# EasyEDA Pro project stm32f103VET6_开发板.eprj, schematic Schematic1

## Sheets
1 主控: Board Name: Board1; Create Date: 2025-05-25; Page Name: 主控; Project Name: stm32f103VET6_开发板; Schematic Name: Schematic1; Update Date: 2025-05-26; Company: 嘉立创EDA; Page Size: A4; Version: V1.0
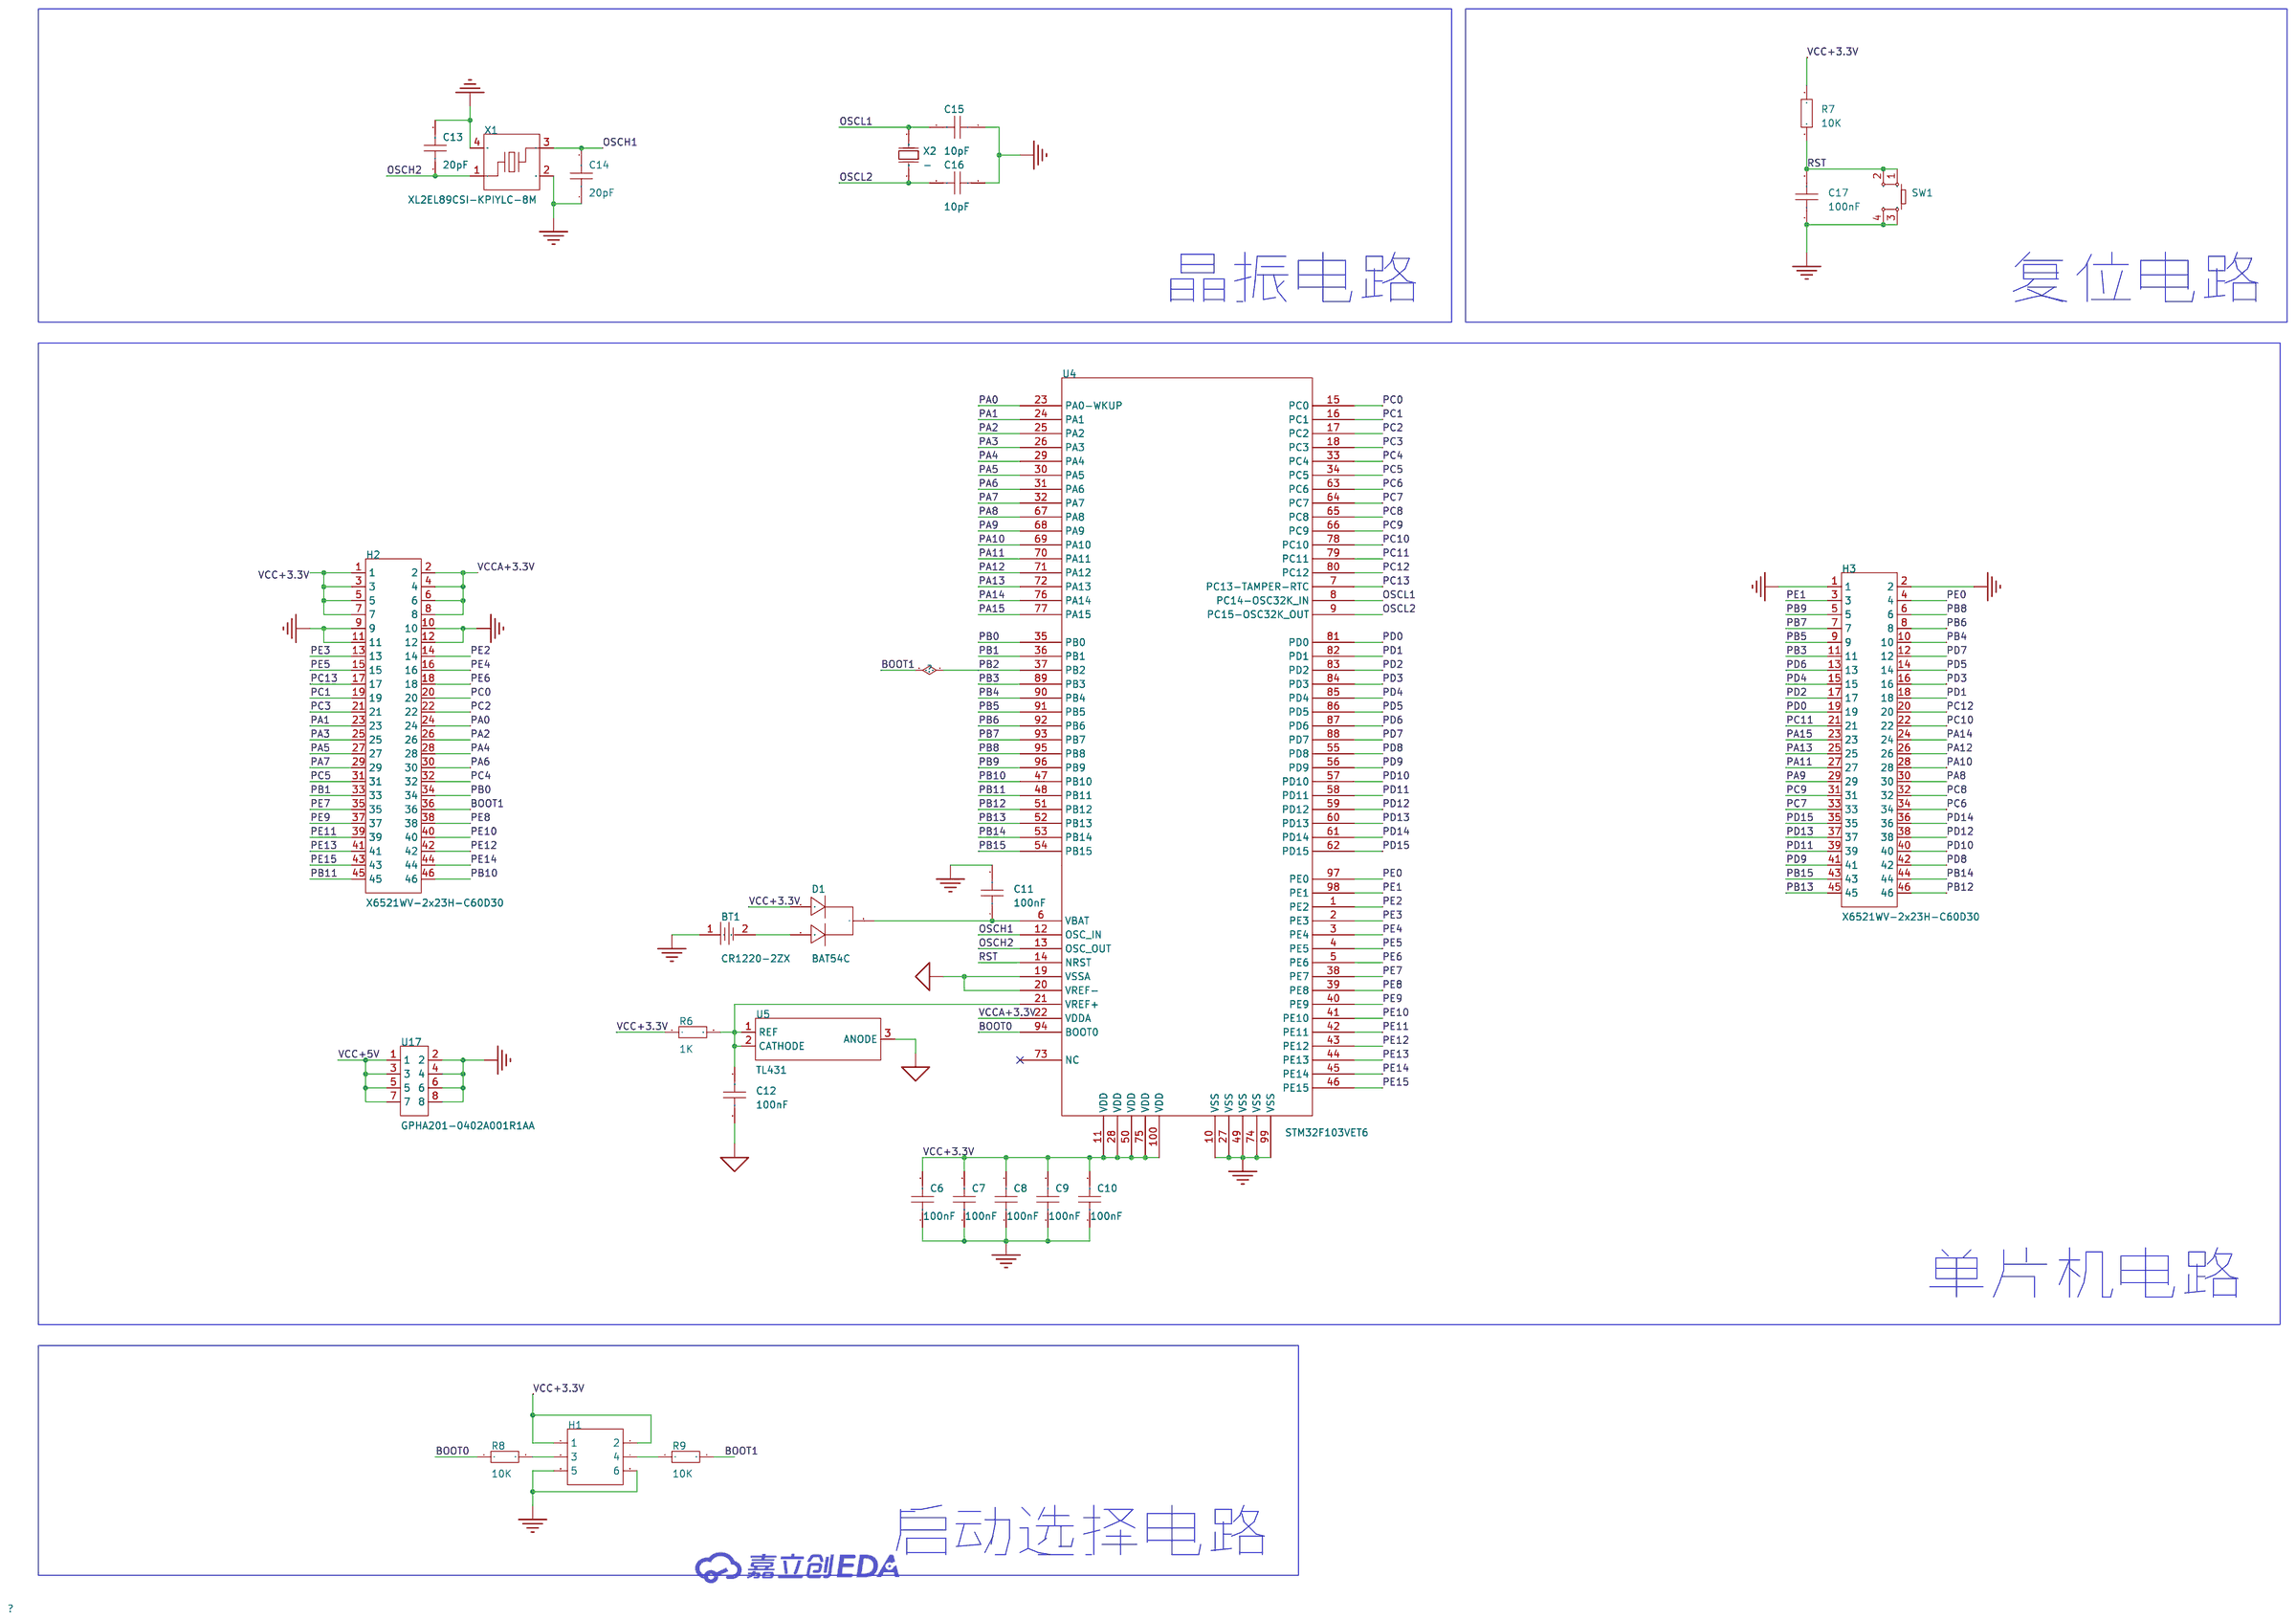
[diagram p0: 主控]
2 电源: Page Name: 电源; Update Date: 2025-05-25
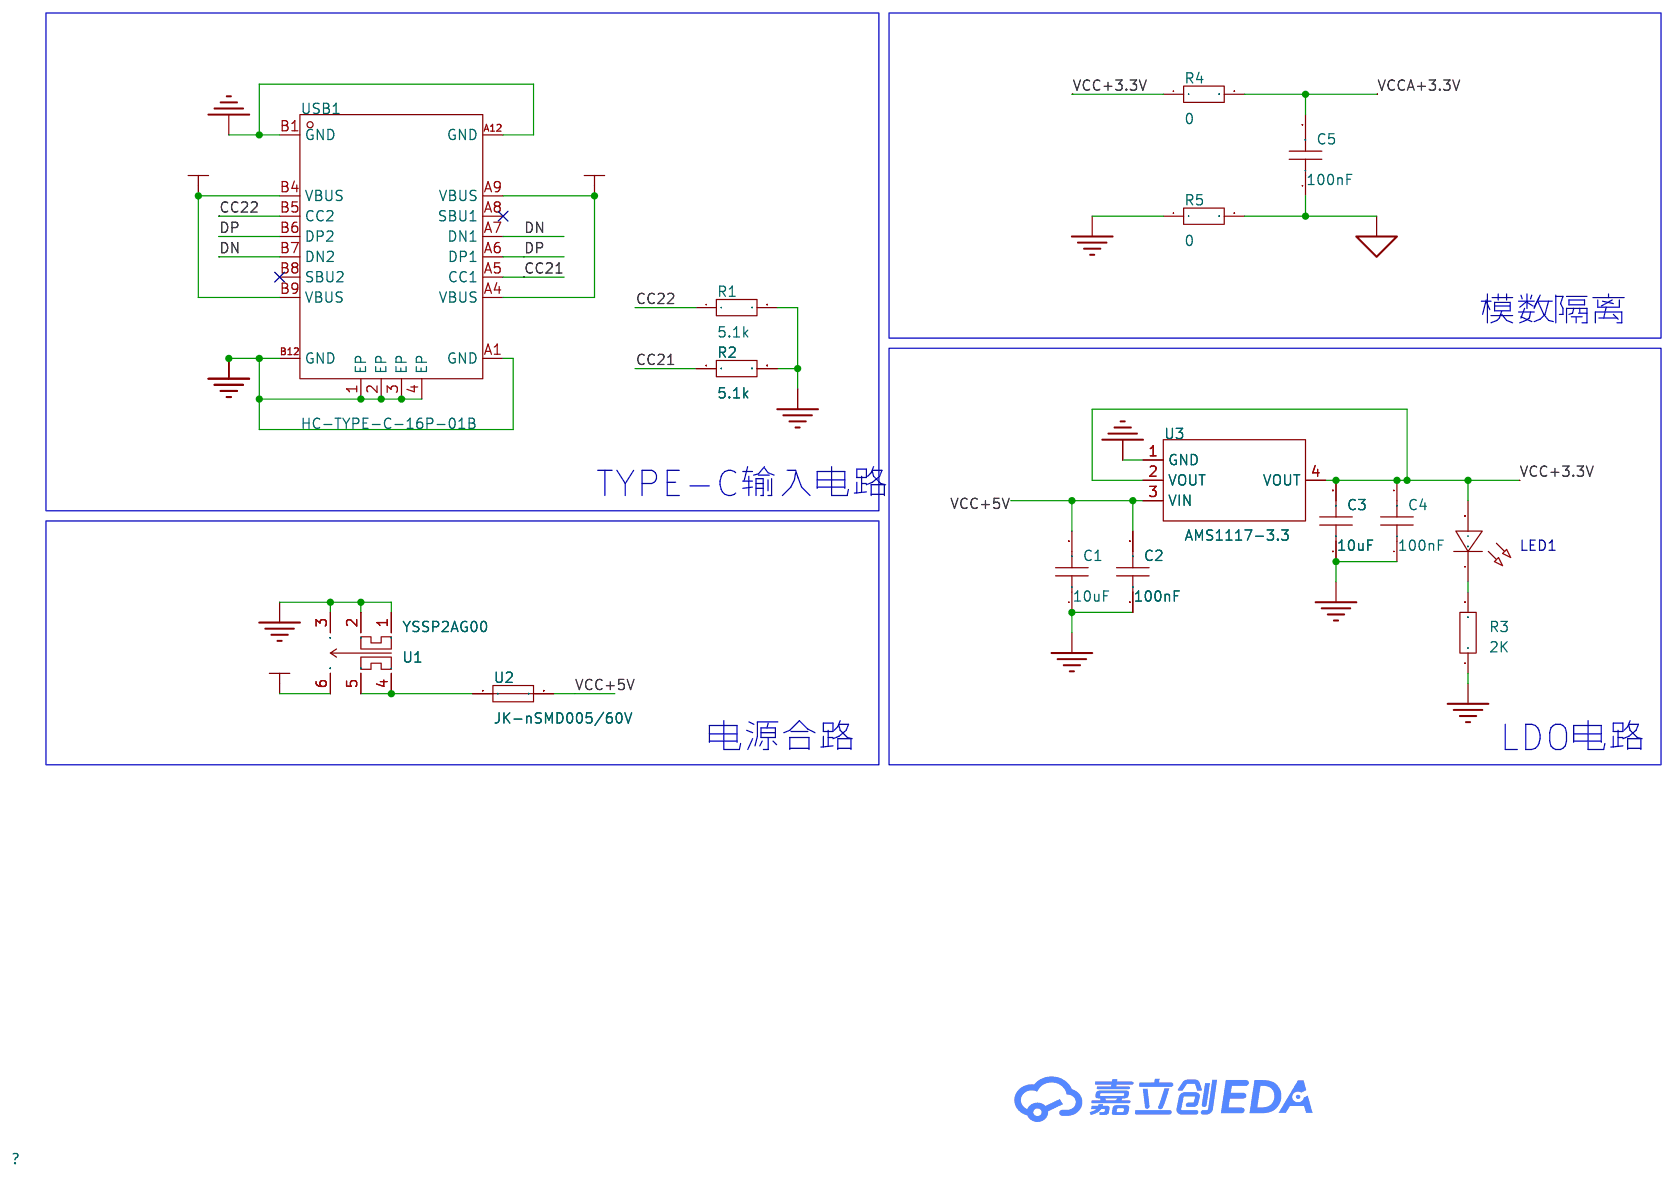
[diagram p1: 电源]
3 接口: Page Name: 接口
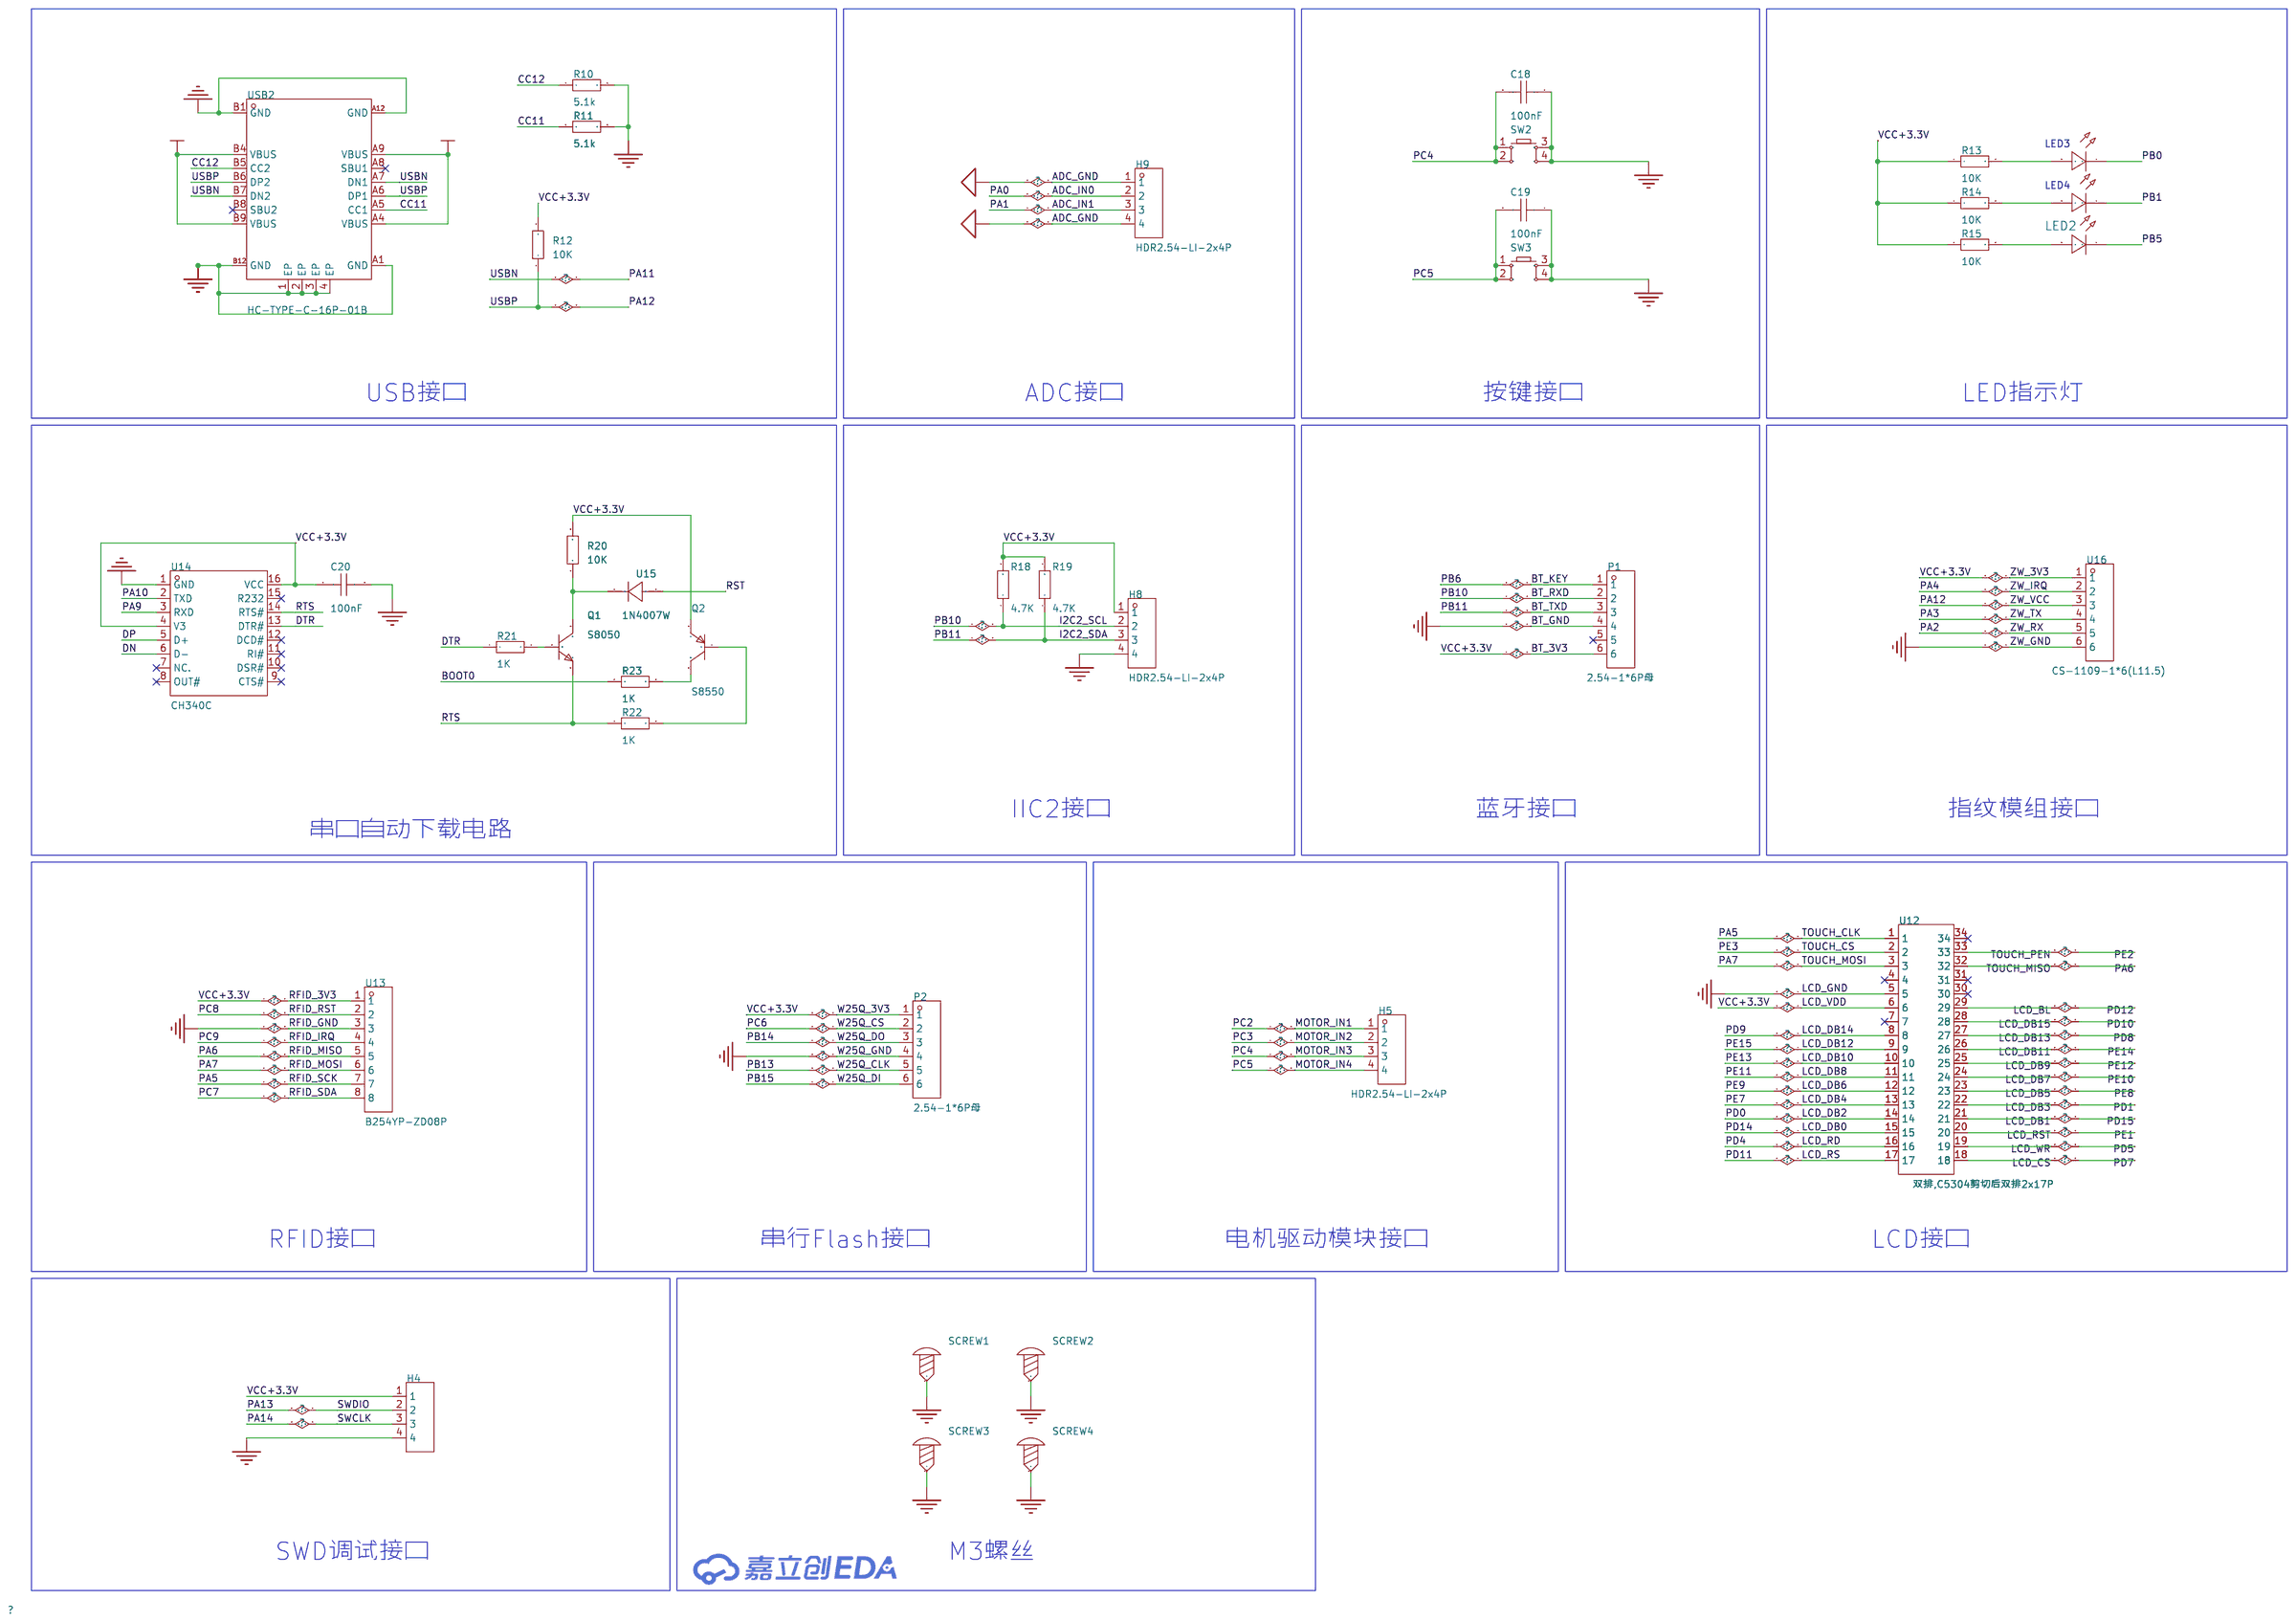
[diagram p2: 接口]

## Parts
sheet 主控
BT1  CR1220-2ZX  [BAT-SMD_CR1220-2ZX]
C6  100nF  [C0603]
C7  100nF  [C0603]
C8  100nF  [C0603]
C9  100nF  [C0603]
C10  100nF  [C0603]
C11  100nF  [C0603]
C12  100nF  [C0603]
C13  20pF  [C0603]
C14  20pF  [C0603]
C15  10pF  [C0603]
C16  10pF  [C0603]
C17  100nF  [C0603]
D1  BAT54C  [SOT-23-3_L2.9-W1.3-P1.90-LS2.4-BR]
H1  -  [HDR-TH_6P-P2.54-V-R2-C3-S2.54_A2541WV-2X3P]
H2  X6521WV-2x23H-C60D30  [HDR-TH_46P-2.54-V-M-R2-C23-S2.54]
H3  X6521WV-2x23H-C60D30  [HDR-TH_46P-2.54-V-M-R2-C23-S2.54]
R6  1K  [R0603]
R7  10K  [R0603]
R8  10K  [R0603]
R9  10K  [R0603]
SW1  -  [SW-SMD_4P-L6.0-W6.0-P4.50-LS9.0-2]
U4  STM32F103VET6  [LQFP-100_L14.0-W14.0-P0.50-LS16.0-BL]
U5  TL431  [SOT-23-3_L2.9-W1.3-P1.90-LS2.4-BR]
U17  GPHA201-0402A001R1AA  [HDR-TH_8P-P2.54-V-M-R2-C4-S2.54]
X1  XL2EL89CSI-KPIYLC-8M  [CRYSTAL-SMD_4P-L3.2-W2.5-BL]
X2  -  [OSC-SMD_L3.2-W1.5]
sheet 接口
C18  100nF  [C0603]
C19  100nF  [C0603]
C20  100nF  [C0603]
H4  -  [HDR-TH_4P-P2.54-V-M]
H5  HDR2.54-LI-2x4P  [HDR-TH_4P-P2.54-V-M]
H8  HDR2.54-LI-2x4P  [HDR-TH_4P-P2.54-V-M]
H9  HDR2.54-LI-2x4P  [HDR-TH_4P-P2.54-V-M]
LED2  -  [LED_0603]
LED3  -  [LED_0603]
LED4  -  [LED_0603]
P1  2.54-1*6P母  [HDR-TH_6P-P2.54-V-F]
P2  2.54-1*6P母  [HDR-TH_6P-P2.54-V-F]
Q1  S8050  [SOT-23-3_L2.9-W1.3-P1.90-LS2.4-BR]
Q2  S8550  [SOT-23-3_L2.9-W1.3-P1.90-LS2.4-BR]
R10  5.1k  [R0603]
R11  5.1k  [R0603]
R12  10K  [R0603]
R13  10K  [R0603]
R14  10K  [R0603]
R15  10K  [R0603]
R18  4.7K  [R0603]
R19  4.7K  [R0603]
R20  10K  [R0603]
R21  1K  [R0603]
R22  1K  [R0603]
R23  1K  [R0603]
SCREW1  -  [M3螺丝]
SCREW2  -  [M3螺丝]
SCREW3  -  [M3螺丝]
SCREW4  -  [M3螺丝]
SW2  -  [SW-SMD_4P-L6.0-W6.0-P4.50-LS9.0-2]
SW3  -  [SW-SMD_4P-L6.0-W6.0-P4.50-LS9.0-2]
U12  双排,C5304剪切后双排2x17P  [HDR-TH_34P-P2.54-V-F-R2-C17-S2.54-1]
U13  B254YP-ZD08P  [HDR-TH_8P-P2.54-V-F]
U14  CH340C  [SOP-16_L10.0-W3.9-P1.27-LS6.0-BL]
U15  1N4007W  [SOD-123FL_L2.7-W1.8-LS3.7-RD]
U16  CS-1109-1*6(L11.5)  [HDR-TH_6P-P2.54-V-M]
USB2  HC-TYPE-C-16P-01B  [USB-C-SMD_KH-TYPE-C-16P]
sheet 电源
C1  10uF  [C0603]
C2  100nF  [C0603]
C3  10uF  [C0603]
C4  100nF  [C0603]
C5  100nF  [C0603]
LED1  -  [LED_0603]
R1  5.1k  [R0603]
R2  5.1k  [R0603]
R3  2K  [R0603]
R4  0  [R0603]
R5  0  [R0603]
U1  YSSP2AG00  [SW-SMD_YSSP2AG00]
U2  JK-nSMD005/60V  [F1206]
U3  AMS1117-3.3  [SOT-223-3_L6.5-W3.4-P2.30-LS7.0-BR]
USB1  HC-TYPE-C-16P-01B  [USB-C-SMD_KH-TYPE-C-16P]

## Library data of the parts
BT1 = CR1220-2ZX: Supplier Part: C969906; Manufacturer: Q&J; Supplier Footprint: SMD; JLCPCB Part Class: 扩展库; Datasheet: https://atta.szlcsc.com/upload/public/pdf/source/20210107/C969906_C1D85B5C66CBBA4D1AEB8467FE1CEC7A.pdf; Supplier: LCSC; Connector Type: 电池底座; Battery Type: CR1220; Operating Temperature Range: -25℃~+85℃
C1-C20 = CAP_0603: Supplier Footprint: 0603
D1 = BAT54C: Supplier Part: C9900013520; Supplier Footprint: SOT-23; JLCPCB Part Class: 扩展库; Supplier: LCSC
H1 = HDR-M_2.54_2x3: Supplier Part: C402781; Supplier Footprint: 插件,P=2.54mm; JLCPCB Part Class: 扩展库
H2 H3 = X6521WV-2x23H-C60D30: LCSC Part Name: 2x23P 间距:2.54mm 方针; Supplier Part: C725895; Manufacturer: XKB Connection(中国星坤); Supplier Footprint: 插件,P=2.54mm; JLCPCB Part Class: 扩展库; Datasheet: https://atta.szlcsc.com/upload/public/pdf/source/20230411/57A4E57F780B9AEBD628250EB464E1CC.pdf; Supplier: LCSC; Pin Structure: 2x23P; Pitch: 2.54mm; Row Spacing: 2.54mm; Circluar Pins/Square Pins: 方针; Number of Rows: 双排; Number of Pins: 46P; Current Rating: 3A; Voltage Rating (Max): 250V; Insulation Height: 2.5mm; Contact Material: 黄铜; Contact Plating: 金; Operating Temperature: -40℃~+105℃; Color: 黑色
R1-R15 R18-R23 = Res_0603: Supplier Footprint: 0603
SW1-SW3 = Key_SMD_6x6x6.5: Supplier Footprint: SMD
U4 = STM32F103VET6: LCSC Part Name: 主流增强型ARM Cortex-M3 MCU，具有512 KB Flash、72 MHz CPU、电机控制、USB和CAN; Supplier Part: C8308; Manufacturer: ST(意法半导体); Supplier Footprint: LQFP-100(14x14); JLCPCB Part Class: 扩展库; Datasheet: https://atta.szlcsc.com/upload/public/pdf/source/20191104/C443969_BBB78F97FCB1C210242AC41DD2A995A0.pdf; Supplier: LCSC; CPU Core: ARM-M3; CPU Maximum Speed: 72MHz; Program Storage Size: 512KB; Program Memory Type: FLASH; Number of I/O: 80; ADC (Bit): 12bit; DAC (Bit): 12bit; Voltage - Supply: 2V~3.6V
U5 = TL431: Supplier Part: C2887585; Manufacturer: YFSEMI(江苏佑风微); Supplier Footprint: SOT-23; JLCPCB Part Class: 扩展库; Datasheet: https://atta.szlcsc.com/upload/public/pdf/source/20211230/94EA76606731071F336A0C78CD912A4F.pdf; Supplier: LCSC
U17 = GPHA201-0402A001R1AA: LCSC Part Name: 2x4P 间距:2.54mm 直插; Supplier Part: C5138864; Manufacturer: GREENCONN(格康); Supplier Footprint: 插件,P=2.54mm; JLCPCB Part Class: 扩展库; Datasheet: https://atta.szlcsc.com/upload/public/pdf/source/20221024/0B21030CC7179B827C2154E4CF59BDB5.pdf; Supplier: LCSC; Pin Structure: 2x4P; Pitch: 2.54mm; Mounting Type: 直插; Number of Rows: 双排; Number of Pins: 8P; Current Rating: 3A; Operating Temperature: -40℃~+105℃
X1 = XL2EL89CSI-KPIYLC-8M: LCSC Part Name: 8MHZ 4P 3225 20PF ±10PPM -40~85℃ (±20PPM) YSX321SL; Supplier Part: C42400161; Manufacturer: YXC(扬兴晶振); Supplier Footprint: SMD3225-4P; Datasheet: https://atta.szlcsc.com/upload/public/pdf/source/20240329/19D5F850207469550BEB00D7DFEDBC7A.pdf; Supplier: LCSC; Normal temperature Frequency Tolerance: ±10ppm; Frequency Stability: ±20ppm
X2 = SF32WK32768D31T002: LCSC Part Name: 3215  32.768KHZ  12.5PF  ±20PPM  -40℃~+85℃; Supplier Part: C271654; Manufacturer: TKD(泰晶); Supplier Footprint: SMD3215-2P; JLCPCB Part Class: 扩展库; Datasheet: https://atta.szlcsc.com/upload/public/pdf/source/20210414/C271654_9FD726E46D0A9E6DACC0E569C8E3A63B.pdf; Supplier: LCSC
H4 = HDR-M_2.54_1x4P: Supplier Part: C492403; Supplier Footprint: 插件; JLCPCB Part Class: 扩展库
H5 H8 H9 = HDR2.54-LI-2x4P: Supplier Part: C9900020145; JLCPCB Part Class: 扩展库; Supplier: LCSC
LED2 = LED_0603-R: Supplier Footprint: 0603
LED1 LED3 = LED_0603-G: Supplier Footprint: 0603
LED4 = LED_0603-B: Supplier Footprint: 0603
P1 P2 = 2.54-1*6P母: LCSC Part Name: 间距:2.54mm 1x6P 直插; Supplier Part: C40877; Manufacturer: BOOMELE(博穆精密); Supplier Footprint: 插件,P=2.54mm; JLCPCB Part Class: 扩展库; Datasheet: https://atta.szlcsc.com/upload/public/pdf/source/20210301/C2718488_F4427B881E42CAA8DDB0B1C12B3A522C.pdf; Supplier: LCSC; Holes Structure: 1x6P; Pitch: 2.54mm; Mounting Type: 直插; Number of Rows: 单排; Number of Holes: 6P
Q1 = S8050: Supplier Part: C2931719; Manufacturer: Doeshare(德芯); Supplier Footprint: SOT-23; JLCPCB Part Class: 扩展库; Datasheet: https://atta.szlcsc.com/upload/public/pdf/source/20220117/E6D3315E0D6ADDB25840BFFAC039C5C0.pdf; Supplier: LCSC
Q2 = S8550: LCSC Part Name: PNP -25V -500mA 120-400 SOT-23; Supplier Part: C2931720; Manufacturer: Doeshare(德芯); Supplier Footprint: SOT-23; JLCPCB Part Class: 扩展库; Datasheet: https://atta.szlcsc.com/upload/public/pdf/source/20220104/15A23F6542E365B9E2BA018BE45092B6.pdf; Supplier: LCSC
SCREW1-SCREW4 = M3螺丝: Supplier Footprint: 插件
U12 = 双排,C5304剪切后双排2x17P: Supplier Part: C9900011356; Supplier Footprint: HDR-TH_34P-P2.54; JLCPCB Part Class: 扩展库; Supplier: LCSC
U13 = B254YP-ZD08P: LCSC Part Name: 排母 间距：2.54mm 1x8P 直插 方孔; Supplier Part: C41413862; Manufacturer: BXCONN(宝讯); Supplier Footprint: 插件,P=2.54mm; JLCPCB Part Class: 扩展库; Datasheet: https://atta.szlcsc.com/upload/public/pdf/source/20240923/74E2CE436646B459B413A9EB99F952A2.pdf; Supplier: LCSC; Holes Structure: 1x8P; Pitch: 2.54mm; Circular Hole / Square Hole: 方孔; Mounting Type: 直插; Number of Rows: 单排; Number of Holes: 8P; Current Rating (Max): 3A; Holes Direction: 顶部; Insulation Height: 8.5mm; Operating Temperature Range: -40℃~+105℃
U14 = CH340C: Supplier Part: C84681; Manufacturer: WCH(南京沁恒); Supplier Footprint: SOP-16; JLCPCB Part Class: 扩展库; Datasheet: https://atta.szlcsc.com/upload/public/pdf/source/20240619/63986D8440D4E5267A77ACD891CC4DE3.pdf; Supplier: LCSC; Applications Function: 收发器; Protocol: USB 2.0; Voltage - Supply: 3.3V；5V; Data Rate: 2Mbps
U15 = 1N4007W_C7528871: LCSC Part Name: 电压:1kV 电流:1A; Supplier Part: C7528871; Manufacturer: MSKSEMI(美森科); Supplier Footprint: SOD-123FL; JLCPCB Part Class: 扩展库; Datasheet: https://atta.szlcsc.com/upload/public/pdf/source/20230821/E9E7B8A13216AEAB33D679873610DFE6.pdf; Supplier: LCSC; Diode Configuration: 独立式; Forward Voltage (Vf@If): 1.1V@1A; Reverse Voltage (Vr): 1kV; Rectified Current: 1A
U16 = CS-1109-1*6(L11.5): Supplier Part: C5142852; Manufacturer: CST(永丰盈); Supplier Footprint: 插件,P=2.54mm; JLCPCB Part Class: 扩展库; Datasheet: https://atta.szlcsc.com/upload/public/pdf/source/20220830/5D3CD2857547A90C8A93F2C65FF02BCC.pdf; Supplier: LCSC; Color: 黑色
USB1 USB2 = HC-TYPE-C-16P-01B: LCSC Part Name: Type-C 母 卧贴; Supplier Part: C2894898; Manufacturer: HCTL(华灿天禄); Supplier Footprint: SMD; JLCPCB Part Class: 扩展库; Datasheet: https://atta.szlcsc.com/upload/public/pdf/source/20221116/A0A1FBB0E7A834DC9555AEBAA987625F.pdf; Supplier: LCSC; Connector Type: Type-C; Gender: 母; Number of Ports: 1; Number of Contacts: 16P; Mounting Style: 卧贴; Current Rating - Power (Max): 3A; Contact Material: 铜; Contact Plating: 金; Operating Temperature Range: -25℃~+85℃; Soldering Temperature(Max): 260℃
U1 = YSSP2AG00: LCSC Part Name: 9x3.6 正按6脚贴片滑动开关; Supplier Part: C5188558; Manufacturer: YIYUAN(怡远); Supplier Footprint: SMD; JLCPCB Part Class: 扩展库; Datasheet: https://atta.szlcsc.com/upload/public/pdf/source/20221011/AF6FF47B5A85181594B051FD518E9363.pdf; Supplier: LCSC
U2 = JK-nSMD005/60V: LCSC Part Name: 60V 0.05A 1206自恢复; Supplier Part: C2830235; Manufacturer: JK(金科); Supplier Footprint: 1206; JLCPCB Part Class: 扩展库; Datasheet: https://atta.szlcsc.com/upload/public/pdf/source/20210427/C2830251_B9511B640A50AD6A91174E2DDDD254CA.pdf; Supplier: LCSC; Voltage - Max: 60V; Current - Max: 100A; Hold Current: 50mA; Trip Current: 150mA; Resistance - Initial (Ri) (Min): 3.6Ω; Resistance - Post Trip (R1) (Max): 50Ω; Time to Trip(Max): 1.5s; Operating Temperature: -40℃~+85℃
U3 = AMS1117-3.3_C6186: LCSC Part Name: 输出3.3V 1A; Supplier Part: C6186; Manufacturer: AMS; Supplier Footprint: SOT-223; JLCPCB Part Class: 基础库; Datasheet: https://atta.szlcsc.com/upload/public/pdf/source/20180727/C6186_7A095716F0823C02F1997A905E26C086.pdf; Supplier: LCSC; Output Type: 固定; Output Voltage: 3.3V; Output Current: 1A; Power Supply Rejection Ratio (PSRR): 72dB@(120Hz); Voltage Dropout: 1.3V@(800mA); Features: 过流保护(OCP)；热关断(TSD); Output Configuration: 正极; Number of Outputs: 1

## Nets
AGND: C5.1 C12.1 H9.1 H9.4 R5.2 U4.19(VSSA) U4.20(VREF-) U5.3(ANODE)
GND: BT1.1 C1.1 C2.1 C3.1 C4.1 C6.1 C7.1 C8.1 C9.1 C10.1 C11.2 C13.2 C14.1 C15.1 C16.1 C17.1 C18.1 C19.1 C20.2 H1.5 H1.6 H2.9 H2.10 H2.11 H2.12 H3.1 H3.2 H4.4 H8.4 P1.4 P2.4 R1.2 R2.2 R3.1 R5.1 R10.2 R11.2 SCREW1.1 SCREW2.1 SCREW3.1 SCREW4.1 SW1.3 SW1.4 SW2.3 SW2.4 SW3.3 SW3.4 U1.1 U1.2 U1.3 U3.1(GND) U4.10(VSS) U4.27(VSS) U4.49(VSS) U4.74(VSS) U4.99(VSS) U12.5 U13.3 U14.1(GND) U16.6 U17.2 U17.4 U17.6 U17.8 USB1.1(EP) USB1.2(EP) USB1.3(EP) USB1.4(EP) USB1.A1(GND) USB1.A12(GND) USB1.B1(GND) USB1.B12(GND) USB2.1(EP) USB2.2(EP) USB2.3(EP) USB2.4(EP) USB2.A1(GND) USB2.A12(GND) USB2.B1(GND) USB2.B12(GND) X1.2(GND) X1.4(GND)
VCC+5V: C1.2 C2.2 U2.2 U3.3(VIN) U17.1 U17.3 U17.5 U17.7
VCCA+3.3V: C5.2 H2.2 H2.4 H2.6 H2.8 R4.2 U4.22(VDDA)
ADC_IN0: H2.24 H9.2 U4.23(PA0-WKUP)
ADC_IN1: H2.23 H9.3 U4.24(PA1)
BOOT0: R8.1 R23.1 U4.94(BOOT0)
BOOT1: H2.36 R9.2 U4.37(PB2)
BT_3V3: C3.2 C4.2 C6.2 C7.2 C8.2 C9.2 C10.2 C20.1 D1.1(A1) H1.1 H1.2 H2.1 H2.3 H2.5 H2.7 H4.1 H8.1 LED1.2(A) P1.6 P2.1 Q2.2(E) R4.1 R6.1 R7.1 R12.2 R13.1 R14.1 R15.1 R18.2 R19.2 R20.2 U3.2(VOUT) U3.4(VOUT) U4.11(VDD) U4.28(VDD) U4.50(VDD) U4.75(VDD) U4.100(VDD) U12.6 U13.1 U14.4(V3) U14.16(VCC) U16.1
BT_KEY: H3.8 P1.1 U4.92(PB6)
BT_RXD: H2.46 H8.2 P1.2 R18.1 U4.47(PB10)
BT_TXD: H2.45 H8.3 P1.3 R19.1 U4.48(PB11)
CC11: R11.1 USB2.A5(CC1)
CC12: R10.1 USB2.B5(CC2)
CC21: R2.1 USB1.A5(CC1)
CC22: R1.1 USB1.B5(CC2)
DN: U14.6(D-) USB1.A7(DN1) USB1.B7(DN2)
DP: U14.5(D+) USB1.A6(DP1) USB1.B6(DP2)
DTR: R21.1 U14.13(DTR#)
LCD_BL: H3.38 U4.59(PD12) U12.29
LCD_CS: H3.12 U4.88(PD7) U12.18
LCD_DB0: H3.36 U4.61(PD14) U12.15
LCD_DB1: H3.35 U4.62(PD15) U12.21
LCD_DB2: H3.19 U4.81(PD0) U12.14
LCD_DB3: H3.18 U4.82(PD1) U12.22
LCD_DB4: H2.35 U4.38(PE7) U12.13
LCD_DB5: H2.38 U4.39(PE8) U12.23
LCD_DB6: H2.37 U4.40(PE9) U12.12
LCD_DB7: H2.40 U4.41(PE10) U12.24
LCD_DB8: H2.39 U4.42(PE11) U12.11
LCD_DB9: H2.42 U4.43(PE12) U12.25
LCD_DB10: H2.41 U4.44(PE13) U12.10
LCD_DB11: H2.44 U4.45(PE14) U12.26
LCD_DB12: H2.43 U4.46(PE15) U12.9
LCD_DB13: H3.42 U4.55(PD8) U12.27
LCD_DB14: H3.41 U4.56(PD9) U12.8
LCD_DB15: H3.40 U4.57(PD10) U12.28
LCD_RD: H3.15 U4.85(PD4) U12.16
LCD_RS: H3.39 U4.58(PD11) U12.17
LCD_RST: H3.3 U4.98(PE1) U12.20
LCD_WR: H3.14 U4.86(PD5) U12.19
MOTOR_IN1: H2.22 H5.1 U4.17(PC2)
MOTOR_IN2: H2.21 H5.2 U4.18(PC3)
MOTOR_IN3: C18.2 H2.32 H5.3 SW2.1 SW2.2 U4.33(PC4)
MOTOR_IN4: C19.2 H2.31 H5.4 SW3.1 SW3.2 U4.34(PC5)
OSCH1: C14.2 U4.12(OSC_IN) X1.3
OSCH2: C13.1 U4.13(OSC_OUT) X1.1
OSCL1: C15.2 U4.8(PC14-OSC32K_IN) X2.2(OSC2)
OSCL2: C16.2 U4.9(PC15-OSC32K_OUT) X2.1(OSC1)
PA2: H2.26 U4.25(PA2) U16.5
PA3: H2.25 U4.26(PA3) U16.4
PA4: H2.28 U4.29(PA4) U16.2
PA5: H2.27 U4.30(PA5) U12.1 U13.7
PA6: H2.30 U4.31(PA6) U12.32 U13.5
PA7: H2.29 U4.32(PA7) U12.3 U13.6
PA8: H3.30 U4.67(PA8)
PA9: H3.29 U4.68(PA9) U14.3(RXD)
PA10: H3.28 U4.69(PA10) U14.2(TXD)
PA11: H3.27 U4.70(PA11) USB2.A7(DN1) USB2.B7(DN2)
PA12: H3.26 R12.1 U4.71(PA12) U16.3 USB2.A6(DP1) USB2.B6(DP2)
PA13: H3.25 H4.2 U4.72(PA13)
PA14: H3.24 H4.3 U4.76(PA14)
PA15: H3.23 U4.77(PA15)
PB0: H2.34 LED3.1(C) U4.35(PB0)
PB1: H2.33 LED4.1(C) U4.36(PB1)
PB3: H3.11 U4.89(PB3)
PB4: H3.10 U4.90(PB4)
PB5: H3.9 LED2.1(C) U4.91(PB5)
PB7: H3.7 U4.93(PB7)
PB8: H3.6 U4.95(PB8)
PB9: H3.5 U4.96(PB9)
PB12: H3.46 U4.51(PB12)
PB13: H3.45 P2.5 U4.52(PB13)
PB14: H3.44 P2.3 U4.53(PB14)
PB15: H3.43 P2.6 U4.54(PB15)
PC0: H2.20 U4.15(PC0)
PC1: H2.19 U4.16(PC1)
PC6: H3.34 P2.2 U4.63(PC6)
PC7: H3.33 U4.64(PC7) U13.8
PC8: H3.32 U4.65(PC8) U13.2
PC9: H3.31 U4.66(PC9) U13.4
PC10: H3.22 U4.78(PC10)
PC11: H3.21 U4.79(PC11)
PC12: H3.20 U4.80(PC12)
PC13: H2.17 U4.7(PC13-TAMPER-RTC)
PD2: H3.17 U4.83(PD2)
PD3: H3.16 U4.84(PD3)
PD6: H3.13 U4.87(PD6)
PD13: H3.37 U4.60(PD13)
PE0: H3.4 U4.97(PE0)
PE2: H2.14 U4.1(PE2) U12.33
PE3: H2.13 U4.2(PE3) U12.2
PE4: H2.16 U4.3(PE4)
PE5: H2.15 U4.4(PE5)
PE6: H2.18 U4.5(PE6)
RST: C17.2 R7.2 SW1.1 SW1.2 U4.14(NRST) U15.2(A)
RTS: Q1.2(E) R22.1 U14.14(RTS#)
USB+5V: U1.6 USB1.A4(VBUS) USB1.A9(VBUS) USB1.B4(VBUS) USB1.B9(VBUS) USB2.A4(VBUS) USB2.A9(VBUS) USB2.B4(VBUS) USB2.B9(VBUS)
$1N1484: BT1.2 D1.2(A2)
$1N1488: C11.1 D1.3(K) U4.6(VBAT)
$1N1847: C12.2 R6.2 U4.21(VREF+) U5.1(REF) U5.2(CATHODE)
$1N2879: H1.3 R8.2
$1N2896: H1.4 R9.1
$2N845: LED1.1(C) R3.2
$2N1294: U1.4 U1.5 U2.1
$3N3163: LED3.2(A) R13.2
$3N3168: LED4.2(A) R14.2
$3N3174: LED2.2(A) R15.2
$3N10021: Q1.3(C) R20.1 U15.1(K)
$3N10042: Q1.1(B) R21.2
$3N10124: Q2.1(B) R22.2
$3N10128: Q2.3(C) R23.2

Not connected (* = marked no-connect by the designer): P1 5*; U4 73(NC)*; U12 4* 7* 30* 31* 34*; U14 7(NC.)* 8(OUT#)* 9(CTS#)* 10(DSR#)* 11(RI#)* 12(DCD#)* 15(R232)*; USB1 A8(SBU1)* B8(SBU2)*; USB2 A8(SBU1)* B8(SBU2)*

## Notes on the sheets
sheet 1
- 晶振电路
- 复位电路
- 单片机电路
- 启动选择电路
sheet 2
- 模数隔离
- TYPE-C输入电路
- 电源合路
- LDO电路
sheet 3
- USB接口
- ADC接口
- 按键接口
- LED指示灯
- IIC2接口
- 蓝牙接口
- 指纹模组接口
- 串口自动下载电路
- RFID接口
- 串行Flash接口
- 电机驱动模块接口
- LCD接口
- SWD调试接口
- M3螺丝
